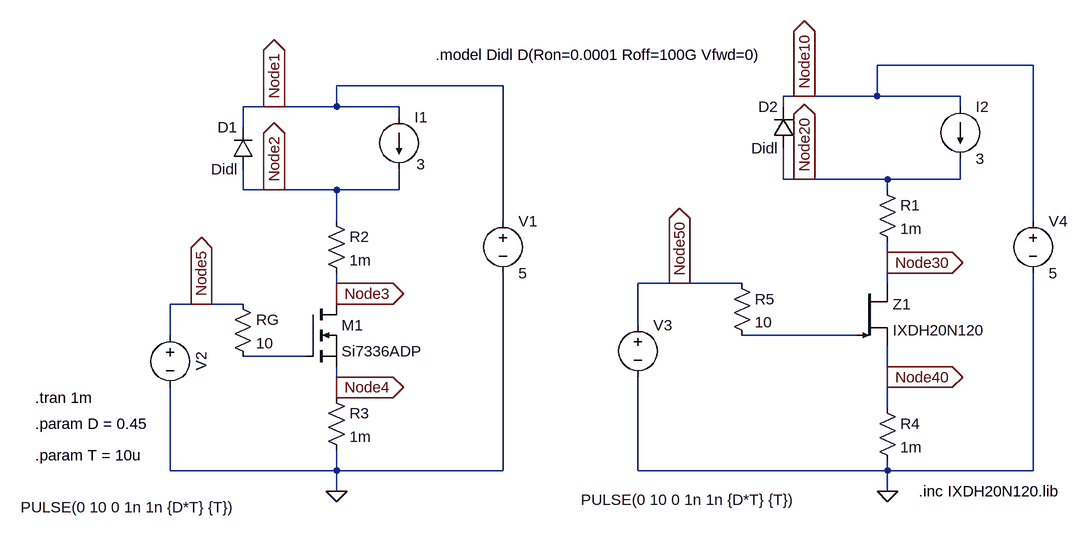
[diagram p0: schematic IGBT_switch_w10_2025_littelfuse_ideal_diode.asc]
IGBT_switch_w10_2025_littelfuse_ideal_diode.asc, the LTspice schematic file:
Version 4
SHEET 1 1880 680
WIRE 1632 -176 1392 -176
WIRE 816 -144 560 -144
WIRE 1280 -128 1248 -128
WIRE 1392 -128 1392 -176
WIRE 1392 -128 1280 -128
WIRE 1520 -128 1392 -128
WIRE 464 -112 416 -112
WIRE 560 -112 560 -144
WIRE 560 -112 464 -112
WIRE 656 -112 560 -112
WIRE 1248 -112 1248 -128
WIRE 1520 -112 1520 -128
WIRE 656 -96 656 -112
WIRE 416 -80 416 -112
WIRE 1248 0 1248 -48
WIRE 1280 0 1248 0
WIRE 1408 0 1280 0
WIRE 1520 0 1520 -32
WIRE 1520 0 1408 0
WIRE 416 16 416 -16
WIRE 464 16 416 16
WIRE 560 16 464 16
WIRE 656 16 656 -16
WIRE 656 16 560 16
WIRE 1408 16 1408 0
WIRE 560 64 560 16
WIRE 816 64 816 -144
WIRE 1632 64 1632 -176
WIRE 1408 128 1408 96
WIRE 1088 160 1024 160
WIRE 1184 160 1088 160
WIRE 1408 160 1408 128
WIRE 560 176 560 144
WIRE 352 192 304 192
WIRE 416 192 352 192
WIRE 560 192 560 176
WIRE 1024 224 1024 160
WIRE 304 240 304 192
WIRE 1360 240 1184 240
WIRE 512 272 416 272
WIRE 1408 304 1408 256
WIRE 560 320 560 288
WIRE 560 336 560 320
WIRE 1408 352 1408 304
WIRE 304 448 304 320
WIRE 560 448 560 416
WIRE 560 448 304 448
WIRE 816 448 816 144
WIRE 816 448 560 448
WIRE 1024 448 1024 304
WIRE 1408 448 1408 432
WIRE 1408 448 1024 448
WIRE 1632 448 1632 144
WIRE 1632 448 1408 448
WIRE 560 480 560 448
WIRE 1408 480 1408 448
FLAG 560 480 0
FLAG 464 -112 Node1
IOPIN 464 -112 Out
FLAG 464 16 Node2
IOPIN 464 16 Out
FLAG 560 176 Node3
IOPIN 560 176 Out
FLAG 560 320 Node4
IOPIN 560 320 Out
FLAG 352 192 Node5
IOPIN 352 192 Out
FLAG 1408 480 0
FLAG 1280 -128 Node10
IOPIN 1280 -128 Out
FLAG 1280 0 Node20
IOPIN 1280 0 Out
FLAG 1408 128 Node30
IOPIN 1408 128 Out
FLAG 1408 304 Node40
IOPIN 1408 304 Out
FLAG 1088 160 Node50
IOPIN 1088 160 Out
SYMBOL voltage 304 224 R0
WINDOW 0 32 56 VTop 2
WINDOW 3 -64 296 Bottom 2
WINDOW 123 0 0 Left 2
WINDOW 39 0 0 Left 2
SYMATTR InstName V2
SYMATTR Value PULSE(0 10 0 1n 1n {D*T} {T})
SYMBOL nmos 512 192 R0
SYMATTR InstName M1
SYMATTR Value Si7336ADP
SYMBOL current 656 -96 R0
WINDOW 3 27 73 Left 2
WINDOW 123 0 0 Left 2
WINDOW 39 0 0 Left 2
SYMATTR Value 3
SYMATTR InstName I1
SYMBOL voltage 816 48 R0
SYMATTR InstName V1
SYMATTR Value 5
SYMBOL res 544 48 R0
SYMATTR InstName R2
SYMATTR Value 1m
SYMBOL res 544 320 R0
SYMATTR InstName R3
SYMATTR Value 1m
SYMBOL diode 432 -16 R180
WINDOW 0 24 64 Left 2
WINDOW 3 24 0 Left 2
SYMATTR InstName D1
SYMATTR Value Didl
SYMBOL res 400 176 R0
SYMATTR InstName RG
SYMATTR Value 10
SYMBOL Misc\\NIGBT 1360 160 R0
SYMATTR InstName Z1
SYMATTR Value IXDH20N120
SYMBOL res 1392 0 R0
SYMATTR InstName R1
SYMATTR Value 1m
SYMBOL res 1392 336 R0
SYMATTR InstName R4
SYMATTR Value 1m
SYMBOL res 1168 144 R0
SYMATTR InstName R5
SYMATTR Value 10
SYMBOL diode 1264 -48 R180
WINDOW 0 24 64 Left 2
WINDOW 3 24 0 Left 2
SYMATTR InstName D2
SYMATTR Value Didl
SYMBOL voltage 1024 208 R0
WINDOW 3 -88 285 Left 2
WINDOW 123 0 0 Left 0
WINDOW 39 0 0 Left 0
SYMATTR Value PULSE(0 10 0 1n 1n {D*T} {T})
SYMATTR InstName V3
SYMBOL voltage 1632 48 R0
SYMATTR InstName V4
SYMATTR Value 5
SYMBOL current 1520 -112 R0
WINDOW 123 0 0 Left 0
WINDOW 39 0 0 Left 0
SYMATTR InstName I2
SYMATTR Value 3
TEXT 96 376 Left 2 !.param D = 0.45
TEXT 96 424 Left 2 !.param T = 10u
TEXT 96 336 Left 2 !.tran 1m
TEXT 1456 480 Left 2 !.inc IXDH20N120.lib
TEXT 712 -192 Left 2 !.model Didl D(Ron=0.0001 Roff=100G Vfwd=0)

The netlist it stands for:
* IGBT_switch_w10_2025_littelfuse_ideal_diode.asc
V2 Node5 0 PULSE(0 10 0 1n 1n {D*T} {T})
M1 Node3 N002 Node4 Node4 Si7336ADP
I1 Node1 Node2 3
V1 Node1 0 5
R2 Node2 Node3 1m
R3 Node4 0 1m
D1 Node2 Node1 Didl
RG Node5 N002 10
Z1 Node30 N001 Node40 IXDH20N120
R1 Node20 Node30 1m
R4 Node40 0 1m
R5 Node50 N001 10
D2 Node20 Node10 Didl
V3 Node50 0 PULSE(0 10 0 1n 1n {D*T} {T})
V4 Node10 0 5
I2 Node10 Node20 3
.model D D
.lib standard.dio
.model NMOS NMOS
.model PMOS PMOS
.lib standard.mos
.param D = 0.45
.param T = 10u
.tran 1m
.inc IXDH20N120.lib
.model Didl D(Ron=0.0001 Roff=100G Vfwd=0)
.backanno
.end